# Altium schematic sheet MPU.SchDoc
size 127 x 101 mm; SheetNumber: 3; SheetTotal: 8
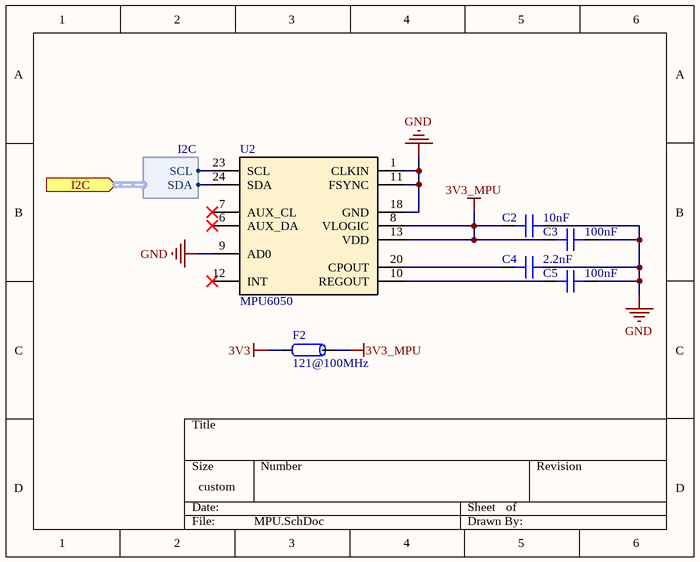
[diagram p0: MPU.SchDoc]

## Parts
C2  10nF  [CAP 0603_1608]
C3  100nF  [CAP 0603_1608]
C4  2.2nF  [CAP 0603_1608]
C5  100nF  [CAP 0603_1608]
F2  121@100MHz  [Ferrite-0805]
U2  MPU6050  [QFN-24TA]

## Ports
I2C (in, harness I2C)

## Harnesses
I2C: SCL, SDA

## Nets
3V3: F2.1
3V3_MPU: C2.2 C3.2 F2.2 U2.8(VLOGIC) U2.13(VDD)
GND: C2.1 C3.1 C4.2 C5.2 U2.1(CLKIN) U2.9(AD0) U2.11(FSYNC) U2.18(GND)
NetC4_1: C4.1 U2.20(CPOUT)
NetC5_1: C5.1 U2.10(REGOUT)
NetU2_23: U2.23(SCL) ; port I2C.SCL
NetU2_24: U2.24(SDA) ; port I2C.SDA

Not connected (* = marked no-connect by the designer): U2 6(AUX_DA)* 7(AUX_CL)* 12(INT)*

## Library data of the parts
C2-C5 = Cap 0603: SMT Capacitor
  C2: VALUE: 10nF
  C3 C5: VALUE: 100nF
  C4: VALUE: 2.2nF
F2 = Ferrite Bead